# Altium project TP1-ASSD.PrjPCB
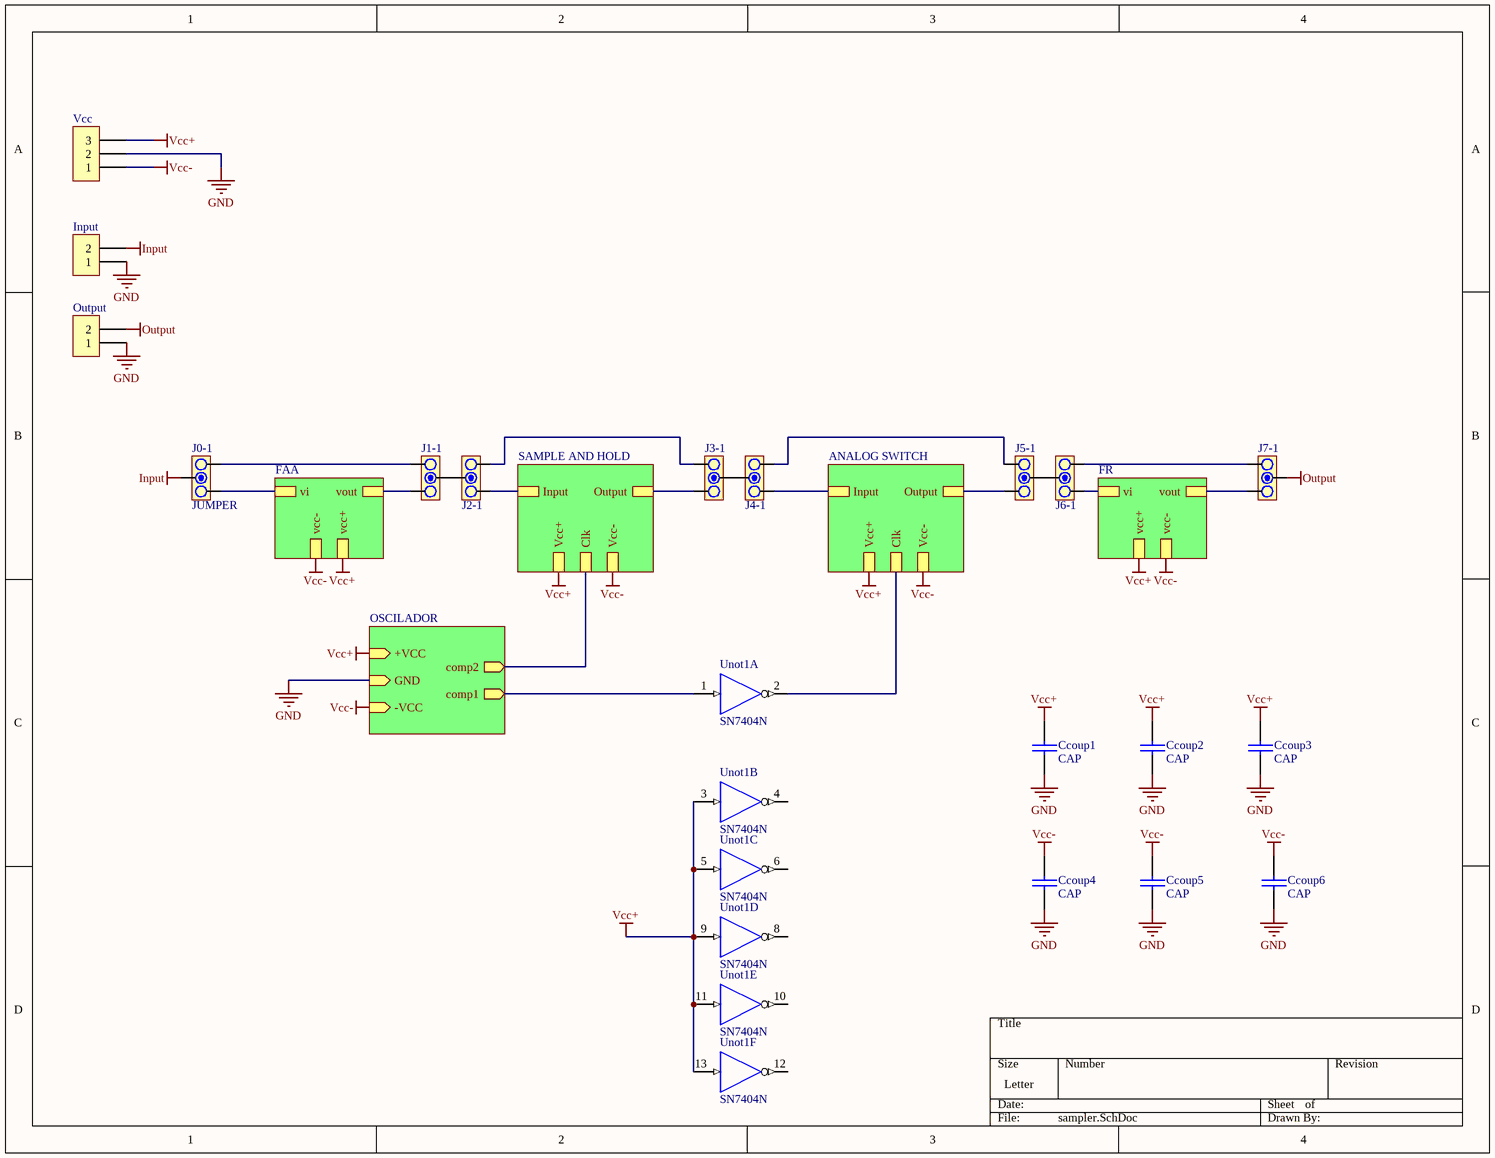
[diagram p0: sampler.SchDoc]
5 sheets, 186 parts. Net scope: hierarchical (ports join the sheet entries above them; power ports are global).
Board file: PCBtodojunto.PcbDoc
Sheets:
  sampler.SchDoc
    SAMPLE AND HOLD = s&h.SchDoc
    OSCILADOR = placaOscilador_TP1_ASSD.SchDoc
    FAA = Schematic.SchDoc
    FR = Schematic.SchDoc
    ANALOG SWITCH = analogSwitch.SchDoc

## Sheet sampler.SchDoc
size Letter

### Parts
Ccoup1  CAP  [CAP200]
Ccoup2  CAP  [CAP200]
Ccoup3  CAP  [CAP200]
Ccoup4  CAP  [CAP200]
Ccoup5  CAP  [CAP200]
Ccoup6  CAP  [CAP200]
Input  BORNERA 2  [BORNERA2]  (value not drawn)
J0-1  JUMPER  [JUMPER3]
J1-1  JUMPER  [JUMPER3]  (value not drawn)
J2-1  JUMPER  [JUMPER3]  (value not drawn)
J3-1  JUMPER  [JUMPER3]  (value not drawn)
J4-1  JUMPER  [JUMPER3]  (value not drawn)
J5-1  JUMPER  [JUMPER3]  (value not drawn)
J6-1  JUMPER  [JUMPER3]  (value not drawn)
J7-1  JUMPER  [JUMPER3]  (value not drawn)
Output  BORNERA 2  [BORNERA2]  (value not drawn)
Unot1  SN7404N  [N014]  (parts A,B,C,D,E,F of 6)
Vcc  BORNERA 3  [BORNERA3]  (value not drawn)

### Sub-sheets
ANALOG SWITCH = analogSwitch.SchDoc: Input, Output, Vcc+, Vcc-, Clk
FAA = Schematic.SchDoc: vcc+, vcc-, vi, vout
FR = Schematic.SchDoc: vcc+, vcc-, vi, vout
OSCILADOR = placaOscilador_TP1_ASSD.SchDoc: +VCC (in), GND (in), -VCC (in), comp2 (out), comp1 (out)
SAMPLE AND HOLD = s&h.SchDoc: Output, Input, Vcc-, Vcc+, Clk

### Nets
Clk1: sheet SAMPLE AND HOLD/Clk, sheet OSCILADOR/comp2
Clk2: Unot1.2(Y) ; sheet ANALOG SWITCH/Clk
Input: Input.2 J0-1.2
Input1: J2-1.3 ; sheet SAMPLE AND HOLD/Input
Input2: J4-1.3 ; sheet ANALOG SWITCH/Input
Output: J7-1.2 Output.2
Output1: J3-1.1 ; sheet SAMPLE AND HOLD/Output
Output2: J5-1.1 ; sheet ANALOG SWITCH/Output
Vcc+: Ccoup1.1 Ccoup2.1 Ccoup3.1 Unot1.3(A) Unot1.5(A) Unot1.9(A) Unot1.11(A) Unot1.13(A) Unot1.14(VCC) Vcc.3 ; sheet SAMPLE AND HOLD/Vcc+, sheet OSCILADOR/+VCC, sheet FAA/vcc+, sheet FR/vcc+, sheet ANALOG SWITCH/Vcc+  [also labelled VCC]
Vcc-: Ccoup1.2 Ccoup2.2 Ccoup3.2 Ccoup4.1 Ccoup4.2 Ccoup5.1 Ccoup5.2 Ccoup6.1 Ccoup6.2 Input.1 Output.1 Unot1.7(GND) Vcc.1 Vcc.2 ; sheet SAMPLE AND HOLD/Vcc-, sheet OSCILADOR/GND, sheet OSCILADOR/-VCC, sheet FAA/vcc-, sheet FR/vcc-, sheet ANALOG SWITCH/Vcc-  [also labelled GND]
Vi: J0-1.3 ; sheet FAA/vi
Vi: J6-1.3 ; sheet FR/vi  [a separate net that carries the same name]
Vo(E5): J1-1.1 ; sheet FAA/vout
Vo(E5): J7-1.1 ; sheet FR/vout  [a separate net that carries the same name]
NetJ0-1_1: J0-1.1 J1-1.3
NetJ1-1_2: J1-1.2 J2-1.2
NetJ2-1_1: J2-1.1 J3-1.3
NetJ3-1_2: J3-1.2 J4-1.2
NetJ4-1_1: J4-1.1 J5-1.3
NetJ5-1_2: J5-1.2 J6-1.2
NetJ6-1_1: J6-1.1 J7-1.3
NetJcomp1_2: Unot1.1(A) ; sheet OSCILADOR/comp1

Not connected (* = marked no-connect by the designer): Unot1 4(Y) 6(Y) 8(Y) 10(Y) 12(Y)

### Library data of the parts
J0-1 J1-1 J2-1 J3-1 J4-1 J5-1 J6-1 J7-1 = JUMPER3
Unot1 = SN7404N: Hex Inverter; Published: 8-Jun-2000; LatestRevisionDate: 04-Mar-2005; LatestRevisionNote: Stylized 3D Model Added.; DatasheetVersion: Mar-1988; PackageVersion: Oct-1995; PackageReference: N014; Publisher: Altium Limited; PackageDescription: DIP; 14 Leads; Row Spacing 7.62 mm; Pitch 2.54 mm; ComponentLink1Description: Manufacturer Link; ComponentLink1URL: http://www.ti.com/; ComponentLink2Description: Datasheet; ComponentLink2URL: http://www-s.ti.com/sc/ds/sn5404.pdf; ComponentLink3Description: Packaging Specification; ComponentLink3URL: http://focus.ti.com/lit/ml/mpdi002c/mpdi002c.pdf

## Sheet s&h.SchDoc
size Letter
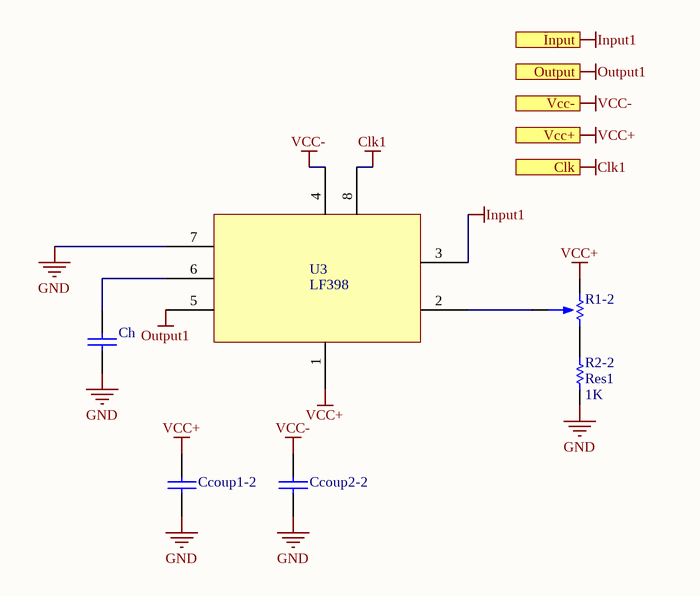
[diagram p1: s&h.SchDoc]

### Parts
Ccoup1-2  CAP  [CAP200]  (value not drawn)
Ccoup2-2  CAP  [CAP200]  (value not drawn)
Ch  CAP  [CAP200]  (value not drawn)
R1-2  PRESET  [PRESET V]  (value not drawn)
R2-2  Res1  value 1K  [AXIAL-0.3]
U3  LF398  [DIP8]

### Ports
Clk, Input, Output, Vcc+, Vcc-

### Nets
Clk1: U3.8(VCC) ; port Clk
Input1: U3.3(OUT) ; port Input
Output1: U3.5(C_VOLTAJE) ; port Output
Vcc+: Ccoup1-2.1 R1-2.3 U3.1(GND) ; port Vcc+
Vcc-: Ccoup1-2.2 Ccoup2-2.1 Ccoup2-2.2 Ch.2 R2-2.1 U3.4(RESET) U3.7(DISCHARGE) ; port Vcc-  [also labelled GND]
NetCh_1: Ch.1 U3.6(THRESHOLD)
NetR1-2_1: R1-2.1 R2-2.2
NetR1-2_2: R1-2.2 U3.2(TRIGGER)

### Library data of the parts
R2-2 = Res1: Resistor; Published: 8-Jun-2000; LatestRevisionDate: 17-Jul-2002; LatestRevisionNote: Re-released for DXP Platform.; PackageReference: AXIAL-0.3; Publisher: Altium Limited; PackageDescription: Axial Device, Thru-Hole; 2 Leads; 0.3 in Pin Spacing
U3 = LM555: Sample and Hold Amplifier

## Sheet placaOscilador_TP1_ASSD.SchDoc
size A4
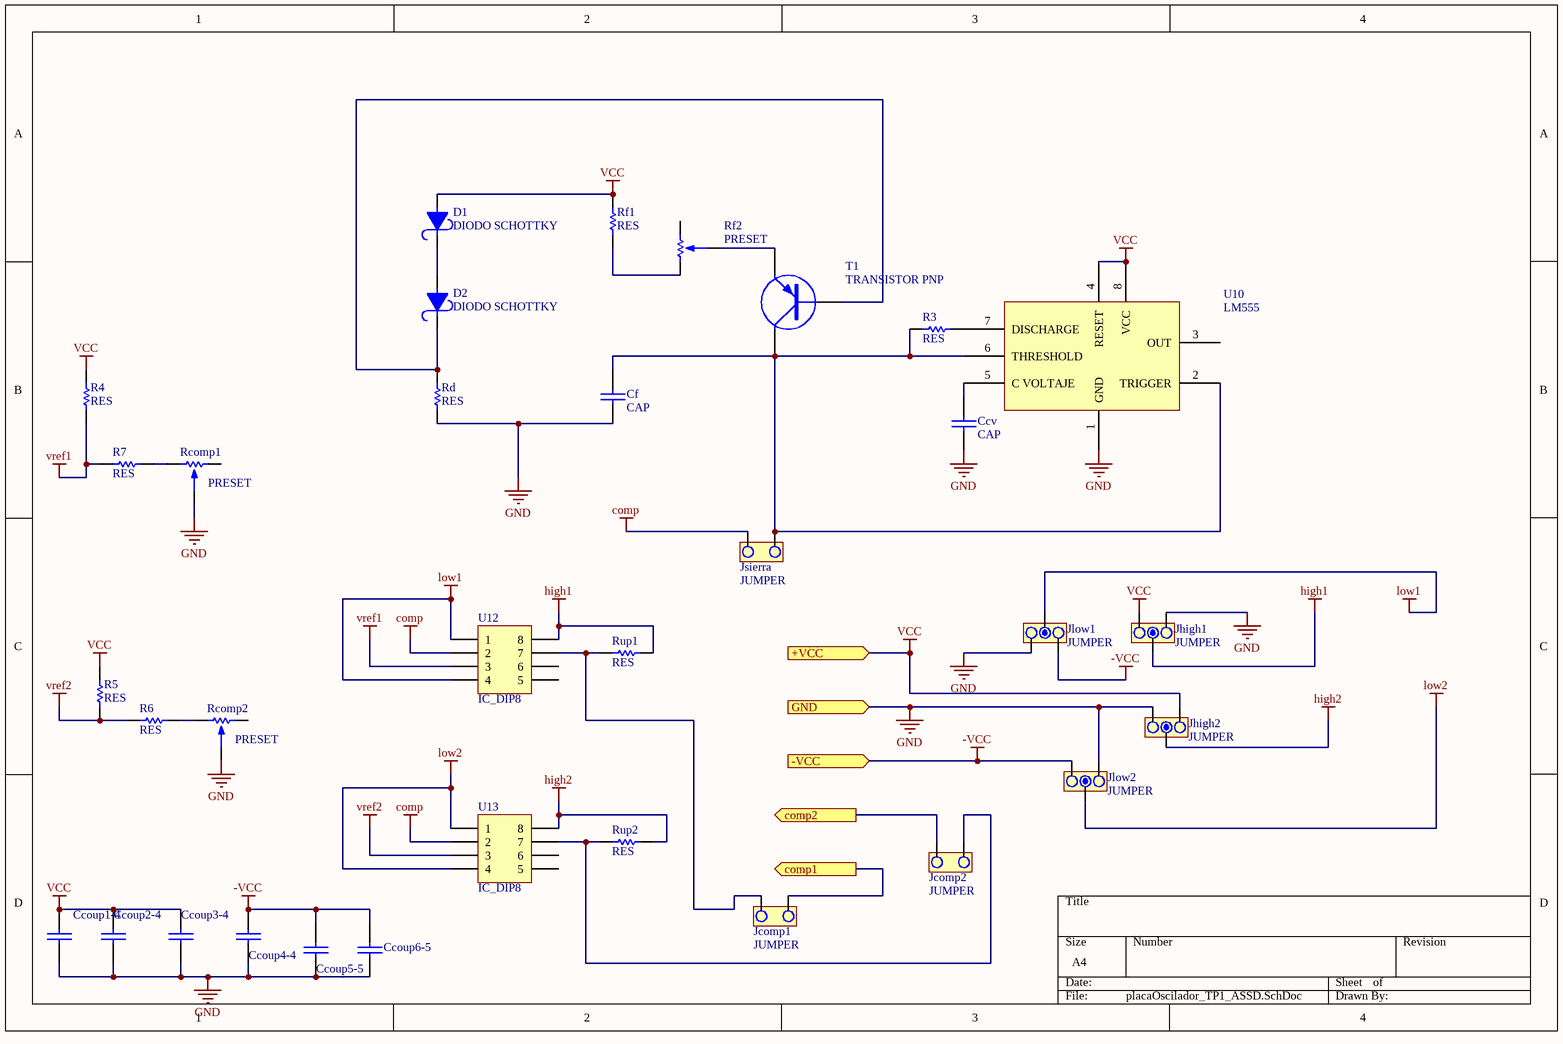
[diagram p2: placaOscilador_TP1_ASSD.SchDoc]

### Parts
Ccoup1-4  CAP  [CAP200]  (value not drawn)
Ccoup2-4  CAP  [CAP200]  (value not drawn)
Ccoup3-4  CAP  [CAP200]  (value not drawn)
Ccoup4-4  CAP  [CAP200]  (value not drawn)
Ccoup5-5  CAP  [CAP200]  (value not drawn)
Ccoup6-5  CAP  [CAP200]  (value not drawn)
Ccv  CAP  [CAP200]
Cf  CAP  [CAP200]
D1  DIODO SCHOTTKY  [DO41]
D2  DIODO SCHOTTKY  [DO41]
Jcomp1  JUMPER  [JUMPER2]
Jcomp2  JUMPER  [JUMPER2]
Jhigh1  JUMPER  [JUMPER3]
Jhigh2  JUMPER  [JUMPER3]
Jlow1  JUMPER  [JUMPER3]
Jlow2  JUMPER  [JUMPER3]
Jsierra  JUMPER  [JUMPER2]
R3  RES  [RES300]
R4  RES  [RES300]
R5  RES  [RES300]
R6  RES  [RES300]
R7  RES  [RES300]
Rcomp1  PRESET  [PRESET V]
Rcomp2  PRESET  [PRESET V]
Rd  RES  [RES300]
Rf1  RES  [RES300]
Rf2  PRESET  [PRESET V]
Rup1  RES  [RES300]
Rup2  RES  [RES300]
T1  TRANSISTOR PNP  [TO92]
U10  LM555  [DIP8]
U12  IC_DIP8  [DIP8]
U13  IC_DIP8  [DIP8]

### Ports
+VCC (in), -VCC (in), comp1 (out), comp2 (out), GND (in)

### Nets
-VCC: Ccoup1-4.2 Ccoup2-4.2 Ccoup3-4.2 Ccoup4-4.1 Ccoup4-4.2 Ccoup5-5.1 Ccoup5-5.2 Ccoup6-5.1 Ccoup6-5.2 Ccv.2 Cf.2 Jhigh1.3 Jhigh2.1 Jlow1.1 Jlow1.3 Jlow2.1 Jlow2.3 Rcomp1.2 Rcomp2.2 Rd.1 U10.1(GND) ; port GND, port -VCC  [also labelled GND]  [project net Vcc-]
Clk1: Jcomp2.1 ; port comp2
comp: Jsierra.1 U12.2 U13.2
high1: Jhigh1.2 Rup1.2 U12.8
high2: Jhigh2.2 Rup2.2 U13.8
low1: Jlow1.2 U12.1 U12.4
low2: Jlow2.2 U13.1 U13.4
VCC: Ccoup1-4.1 Ccoup2-4.1 Ccoup3-4.1 D1.1 Jhigh1.1 Jhigh2.3 R4.2 R5.2 Rf1.2 U10.4(RESET) U10.8(VCC) ; port +VCC  [project net Vcc+]
vref1: R4.1 R7.1 U12.3
vref2: R5.1 R6.1 U13.3
NetCcv_1: Ccv.1 U10.5(C_VOLTAJE)
NetCf_1: Cf.1 Jsierra.2 R3.1 T1.2(C) U10.2(TRIGGER) U10.6(THRESHOLD)
NetD1_2: D1.2 D2.1
NetD2_2: D2.2 Rd.2 T1.1(B)
NetJcomp1_1: Jcomp1.1 Rup1.1 U12.7
NetJcomp1_2: Jcomp1.2 ; port comp1
NetJcomp2_2: Jcomp2.2 Rup2.1 U13.7
NetR3_2: R3.2 U10.7(DISCHARGE)
NetR6_2: R6.2 Rcomp2.3
NetR7_2: R7.2 Rcomp1.3
NetRf1_1: Rf1.1 Rf2.3
NetRf2_2: Rf2.2 T1.3(E)

Not connected (* = marked no-connect by the designer): Rcomp1 1; Rcomp2 1; Rf2 1; U10 3(OUT); U12 5 6; U13 5 6

### Library data of the parts
Jhigh1 Jhigh2 Jlow1 Jlow2 = JUMPER3
U10 = LM555: Timer

## Sheet Schematic.SchDoc
size A4
Used 2 times, as channels FAA, FR. Parts and nets are listed once, with the designators drawn on the sheet.
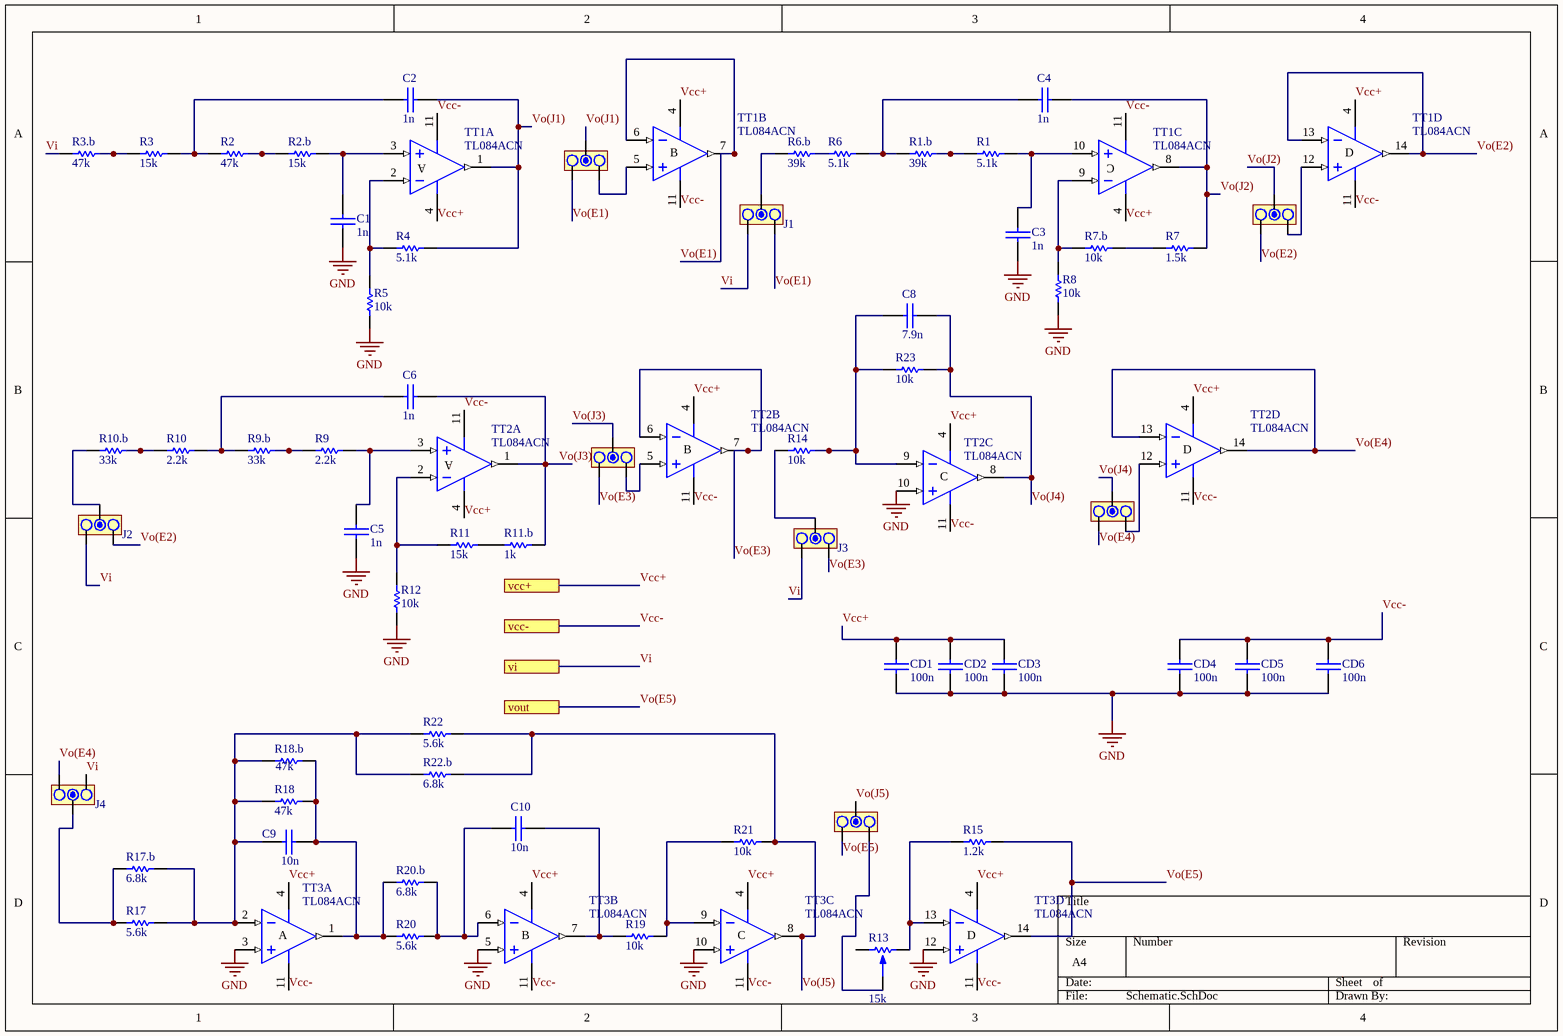
[diagram p3: Schematic.SchDoc]

### Parts
C1  1n  [CAP200]
C2  1n  [CAP200]
C3  1n  [CAP200]
C4  1n  [CAP200]
C5  1n  [CAP200]
C6  1n  [CAP200]
C8  7.9n  [CAP200]
C9  10n  [CAP200]
C10  10n  [CAP200]
CD1  100n  [CAP200]
CD2  100n  [CAP200]
CD3  100n  [CAP200]
CD4  100n  [CAP200]
CD5  100n  [CAP200]
CD6  100n  [CAP200]
J1  JUMPER  [JUMPER3]  (value not drawn)
J2  JUMPER  [JUMPER3]  (value not drawn)
J3  JUMPER  [JUMPER3]  (value not drawn)
J4  JUMPER  [JUMPER3]  (value not drawn)
Jumper1  JUMPER  [JUMPER3]  (value not drawn)
Jumper2  JUMPER  [JUMPER3]  (value not drawn)
Jumper3  JUMPER  [JUMPER3]  (value not drawn)
Jumper4  JUMPER  [JUMPER3]  (value not drawn)
Jumper5  JUMPER  [JUMPER3]  (value not drawn)
R1  5.1k  [RES400]
R1.b  39k  [RES400]
R2  47k  [RES400]
R2.b  15k  [RES400]
R3  15k  [RES400]
R3.b  47k  [RES400]
R4  5.1k  [RES400]
R5  10k  [RES400]
R6  5.1k  [RES400]
R6.b  39k  [RES400]
R7  1.5k  [RES400]
R7.b  10k  [RES400]
R8  10k  [RES400]
R9  2.2k  [RES400]
R9.b  33k  [RES400]
R10  2.2k  [RES400]
R10.b  33k  [RES400]
R11  15k  [RES400]
R11.b  1k  [RES400]
R12  10k  [RES400]
R13  15k  [PRESET V]
R14  10k  [RES400]
R15  1.2k  [RES400]
R17  5.6k  [RES400]
R17.b  6.8k  [RES400]
R18  47k  [RES400]
R18.b  47k  [RES400]
R19  10k  [RES400]
R20  5.6k  [RES400]
R20.b  6.8k  [RES400]
R21  10k  [RES400]
R22  5.6k  [RES400]
R22.b  6.8k  [RES400]
R23  10k  [RES400]
TT1  TL084ACN  [DIP14]  (parts A,B,C,D of 4)
TT2  TL084ACN  [DIP14]  (parts A,B,C,D of 4)
TT3  TL084ACN  [DIP14]  (parts A,B,C,D of 4)

### Ports
vcc+, vcc-, vi, vout

### Nets
GND: C1.1 C3.1 C5.1 CD1.2 CD2.2 CD3.2 CD4.2 CD5.2 CD6.2 R5.1 R8.1 R12.1 TT2.10(IN+) TT3.3(IN+) TT3.5(IN+) TT3.10(IN+) TT3.12(IN+)
Vcc+: CD1.1 CD2.1 CD3.1 TT1.4(V+) TT2.4(V+) TT3.4(V+) ; port vcc+
Vcc-: CD4.1 CD5.1 CD6.1 TT1.11(V-) TT2.11(V-) TT3.11(V-) ; port vcc-
Vi: J1.3 J2.3 J3.3 J4.3 R3.b.1 ; port vi
Vo(E1): J1.1 Jumper1.3 TT1.6(IN-) TT1.7(OUT)
Vo(E2): J2.1 Jumper2.3 TT1.13(IN-) TT1.14(OUT)
Vo(E3): J3.1 Jumper3.3 TT2.6(IN-) TT2.7(OUT)
Vo(E4): J4.1 Jumper4.3 TT2.13(IN-) TT2.14(OUT)
Vo(E5): Jumper5.3 R15.2 TT3.14(OUT) ; port vout
Vo(J1): C2.2 Jumper1.2 R4.1 TT1.1(OUT)
Vo(J2): C4.2 Jumper2.2 R7.2 TT1.8(OUT)
Vo(J3): C6.2 Jumper3.2 R11.b.1 TT2.1(OUT)
Vo(J4): C8.2 Jumper4.2 R23.2 TT2.8(OUT)
Vo(J5): Jumper5.2 R21.2 R22.2 R22.b.2 TT3.8(OUT)
NetC1_2: C1.2 R2.b.2 TT1.3(IN+)
NetC2_1: C2.1 R2.1 R3.2
NetC3_2: C3.2 R1.2 TT1.10(IN+)
NetC4_1: C4.1 R1.b.1 R6.2
NetC5_2: C5.2 R9.2 TT2.3(IN+)
NetC6_1: C6.1 R9.b.1 R10.2
NetC8_1: C8.1 R14.2 R23.1 TT2.9(IN-)
NetC9_1: C9.1 R17.2 R17.b.2 R18.1 R18.b.1 R22.1 R22.b.1 TT3.2(IN-)
NetC9_2: C9.2 R18.2 R18.b.2 R20.1 R20.b.1 TT3.1(OUT)
NetC10_1: C10.1 R20.2 R20.b.2 TT3.6(IN-)
NetC10_2: C10.2 R19.1 TT3.7(OUT)
NetJ1_2: J1.2 R6.b.1
NetJ2_2: J2.2 R10.b.1
NetJ3_2: J3.2 R14.1
NetJ4_2: J4.2 R17.1 R17.b.1
NetJumper1_1: Jumper1.1 TT1.5(IN+)
NetJumper2_1: Jumper2.1 TT1.12(IN+)
NetJumper3_1: Jumper3.1 TT2.5(IN+)
NetJumper4_1: Jumper4.1 TT2.12(IN+)
NetJumper5_1: Jumper5.1 R13.2
NetR1_1: R1.1 R1.b.2
NetR2_2: R2.2 R2.b.1
NetR3_1: R3.1 R3.b.2
NetR4_2: R4.2 R5.2 TT1.2(IN-)
NetR6_1: R6.1 R6.b.2
NetR7.b_2: R7.b.2 R8.2 TT1.9(IN-)
NetR7_1: R7.1 R7.b.1
NetR9_1: R9.1 R9.b.2
NetR10_1: R10.1 R10.b.2
NetR11_1: R11.1 R11.b.2
NetR11_2: R11.2 R12.2 TT2.2(IN-)
NetR13_1: R13.1 R15.1 TT3.13(IN-)
NetR19_2: R19.2 R21.1 TT3.9(IN-)

Not connected (* = marked no-connect by the designer): R13 3

### Channels
FAA: designators end in _FAA; ports vcc+=Vcc+ vcc-=Vcc- vi=Vi vout=Vo(E5)
FR: designators end in _FR; ports vcc+=Vcc+ vcc-=Vcc- vi=Vi vout=Vo(E5)

### Notes on the sheet
- (in symbol TL084ACN, part A) A
- (in symbol TL084ACN, part B) B
- (in symbol TL084ACN, part C) C
- (in symbol TL084ACN, part D) D

### Library data of the parts
C1-C6 C8-C10 CD1-CD6 = CAP
J1-J4 Jumper1-Jumper5 = JUMPER3
R1 R1.b R2 R2.b R3 R3.b R4-R6 R6.b R7 R7.b R8 R9 R9.b R10 R10.b R11 R11.b R12 R14 R15 R17 R17.b R18 R18.b R19 R20 R20.b R21 R22 R22.b R23 = RES
R13 = PRESET
TT1-TT3 = TL084ACN: General-Purpose J-FET Quad Operational Amplifier; Published: 24-Aug-2001; LatestRevisionDate: 06-Jun-2005; LatestRevisionNote: Stylized 3D Model Added.; DatasheetVersion: Jan-1999; PackageVersion: Jan-1997; PackageReference: DIP14; Publisher: Altium Limited; PackageDescription: DIP; 14 Leads; Row Spacing 7.62 mm; Pitch 2.54 mm; ComponentLink1Description: Manufacturer Link; ComponentLink1URL: http://www.st.com/; ComponentLink2Description: Datasheet; ComponentLink2URL: http://www.st.com/stonline/products/literature/ds/2301/tl084.pdf

## Sheet analogSwitch.SchDoc
size Letter
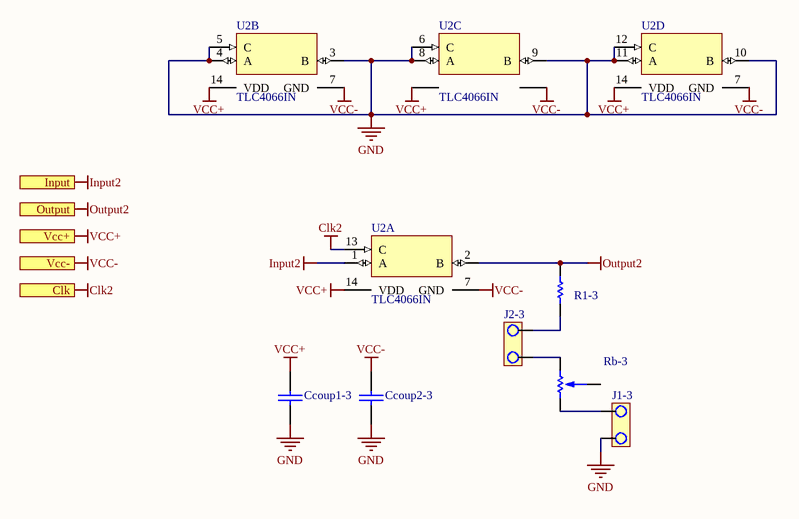
[diagram p4: analogSwitch.SchDoc]

### Parts
Ccoup1-3  CAP  [CAP200]  (value not drawn)
Ccoup2-3  CAP  [CAP200]  (value not drawn)
J1-3  JUMPER  [JUMPER2]  (value not drawn)
J2-3  JUMPER  [JUMPER2]  (value not drawn)
R1-3  Res1  [AXIAL-0.3]  (value not drawn)
Rb-3  PRESET  [PRESET V]  (value not drawn)
U2  TLC4066IN  [N014]  (parts A,B,C,D of 4)

### Ports
Clk, Input, Output, Vcc+, Vcc-

### Nets
Clk2: U2.13(C) ; port Clk
Input2: U2.1(A) ; port Input
Output2: R1-3.2 U2.2(B) ; port Output
Vcc+: Ccoup1-3.1 U2.14(VDD) ; port Vcc+  [also labelled VDD]
Vcc-: Ccoup1-3.2 Ccoup2-3.1 Ccoup2-3.2 J1-3.1 U2.3(B) U2.4(A) U2.5(C) U2.6(C) U2.7(GND) U2.8(A) U2.9(B) U2.10(B) U2.11(A) U2.12(C) ; port Vcc-  [also labelled GND]
NetJ1-3_2: J1-3.2 Rb-3.3
NetJ2-3_1: J2-3.1 R1-3.1
NetJ2-3_2: J2-3.2 Rb-3.1

Not connected (* = marked no-connect by the designer): Rb-3 2

### Library data of the parts
R1-3 = Res1: Resistor; Published: 8-Jun-2000; LatestRevisionDate: 17-Jul-2002; LatestRevisionNote: Re-released for DXP Platform.; PackageReference: AXIAL-0.3; Publisher: Altium Limited; PackageDescription: Axial Device, Thru-Hole; 2 Leads; 0.3 in Pin Spacing
U2 = TLC4066IN: Quadruple Bilateral Analog Switch; Published: 8-Jun-2000; LatestRevisionDate: 04-Mar-2005; LatestRevisionNote: Stylized 3D Model Added.; DatasheetVersion: Jan-1986; PackageVersion: Oct-1995; PackageReference: N014; Publisher: Altium Limited; PackageDescription: DIP; 14 Leads; Row Spacing 7.62 mm; Pitch 2.54 mm; ComponentLink1Description: Manufacturer Link; ComponentLink1URL: http://www.ti.com/

## Nets that join several sheets
Clk1: s&h (U3.8), placaOscilador_TP1_ASSD (Jcomp2.1)
Clk2: sampler (Unot1.2), analogSwitch (U2.13)
Input1: sampler (J2-1.3), s&h (U3.3)
Input2: sampler (J4-1.3), analogSwitch (U2.1)
Output1: sampler (J3-1.1), s&h (U3.5)
Output2: sampler (J5-1.1), analogSwitch (R1-3.2 U2.2)
Vcc+: sampler (10 pins), s&h (Ccoup1-2.1 R1-2.3 U3.1), placaOscilador_TP1_ASSD (11 pins), FAA (6 pins), FR (6 pins), analogSwitch (Ccoup1-3.1 U2.14)
Vcc-: sampler (14 pins), s&h (7 pins), placaOscilador_TP1_ASSD (21 pins), FAA (23 pins), FR (23 pins), analogSwitch (14 pins)
NetJcomp1_2: sampler (Unot1.1), placaOscilador_TP1_ASSD (Jcomp1.2)
Vi: sampler (J0-1.3), FAA (5 pins)
Vi: sampler (J6-1.3), FR (5 pins)
Vo(E5): sampler (J1-1.1), FAA (Jumper5_FAA.3 R15_FAA.2 TT3_FAA.14)
Vo(E5): sampler (J7-1.1), FR (Jumper5_FR.3 R15_FR.2 TT3_FR.14)